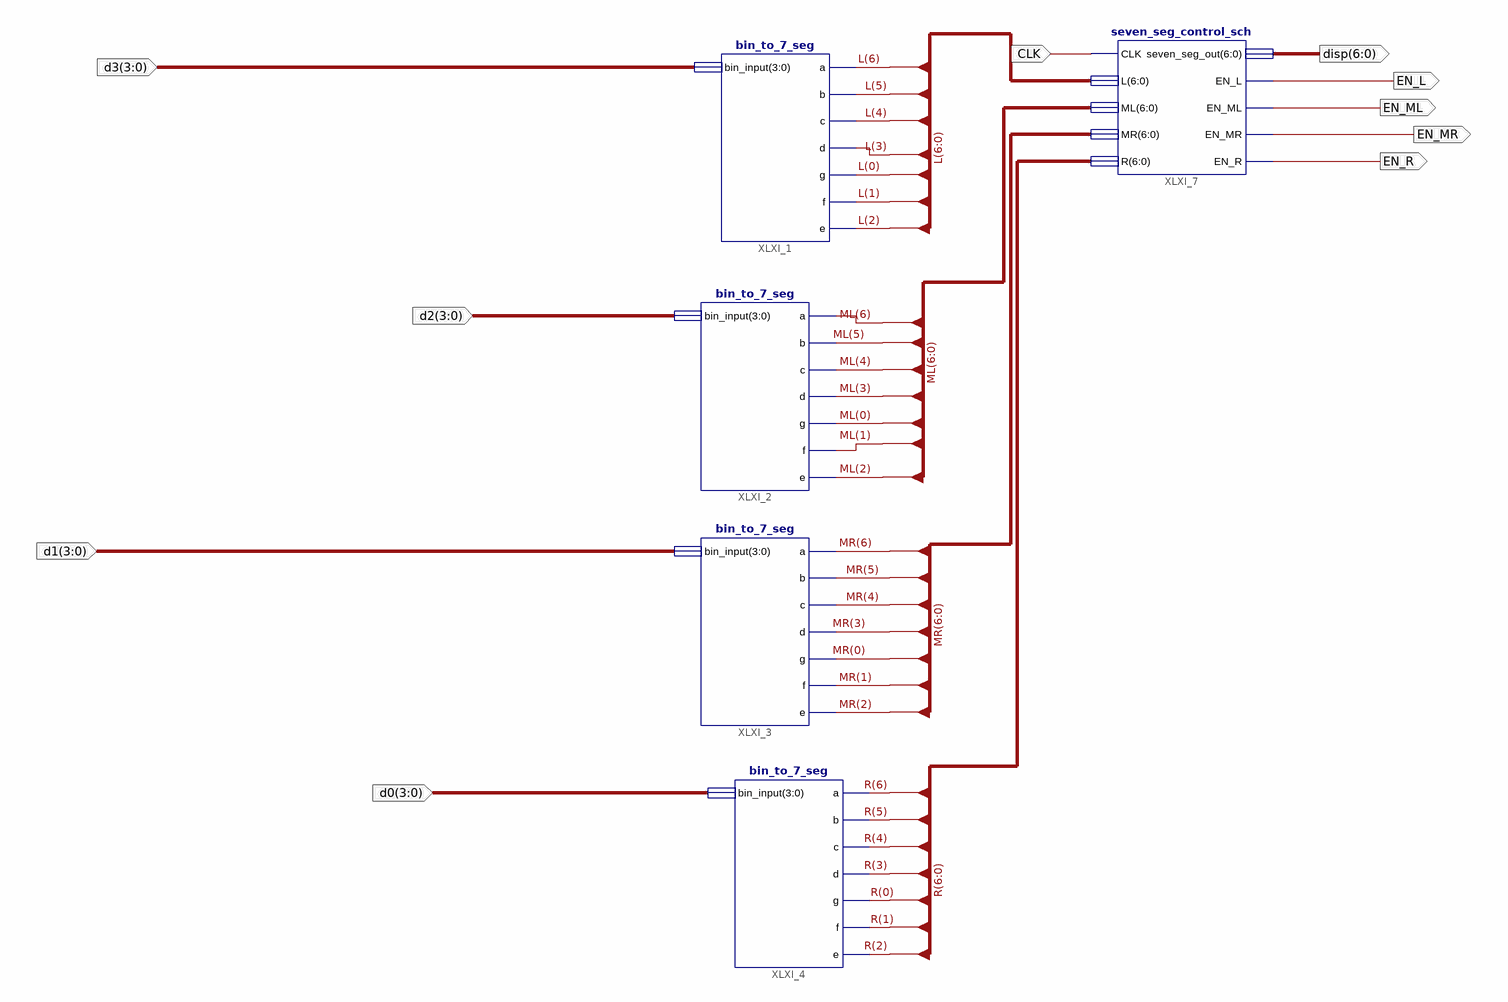
[diagram p0: schematic sheet 1]
// Xilinx ISE schematic seven_seg_4col.sch (spartan3e) as structural Verilog: 5 symbols, 10 ports
module seven_seg_4col (
  input  [3:0] d3,
  input  [3:0] d1,
  input  CLK,
  input  [3:0] d0,
  input  [3:0] d2,
  output [6:0] disp,
  output EN_L,
  output EN_ML,
  output EN_R,
  output EN_MR
);

  wire [6:0] L, ML, MR, R;

  bin_to_7_seg XLXI_1 (.bin_input(d3), .a(L[6]), .b(L[5]), .c(L[4]), .d(L[3]), .g(L[0]), .f(L[1]), .e(L[2]));
  bin_to_7_seg XLXI_2 (.bin_input(d2), .a(ML[6]), .b(ML[5]), .c(ML[4]), .d(ML[3]), .g(ML[0]), .f(ML[1]), .e(ML[2]));
  bin_to_7_seg XLXI_3 (.bin_input(d1), .a(MR[6]), .b(MR[5]), .c(MR[4]), .d(MR[3]), .g(MR[0]), .f(MR[1]), .e(MR[2]));
  bin_to_7_seg XLXI_4 (.bin_input(d0), .a(R[6]), .b(R[5]), .c(R[4]), .d(R[3]), .g(R[0]), .f(R[1]), .e(R[2]));
  seven_seg_control_sch XLXI_7 (
    .CLK(CLK), .L(L), .ML(ML), .MR(MR), .R(R), .EN_MR(EN_MR), .EN_L(EN_L), .EN_ML(EN_ML), .EN_R(EN_R),
    .seven_seg_out(disp));
endmodule
